# EAGLE design Blocky_ESP32 (EAGLE 9.2.2)
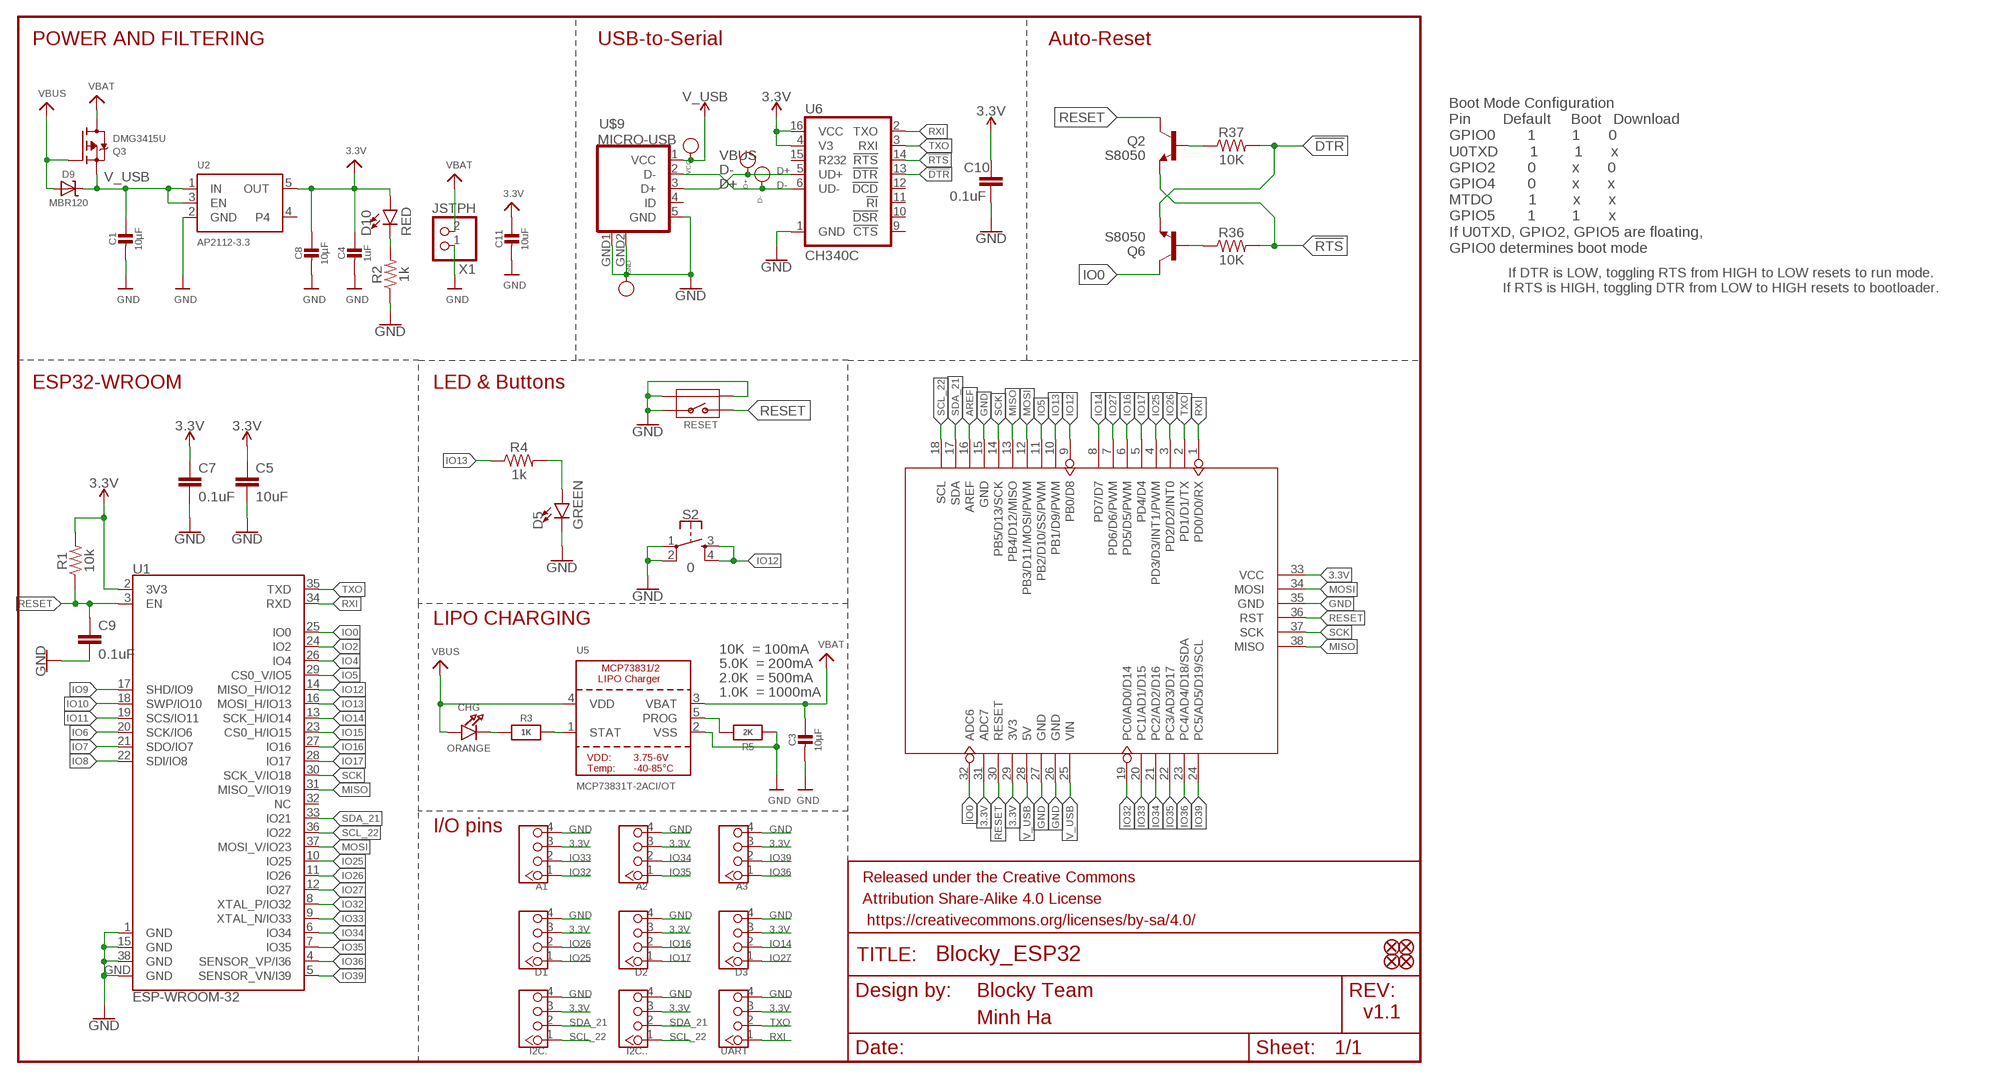
[diagram p0: schematic, sheet 1]

## Parts
A1  TWIG-4P-2.0-2.0  [4P-2.0]
A2  TWIG-4P-2.0-2.0  [4P-2.0]
A3  TWIG-4P-2.0-2.0  [4P-2.0]
C1  10µF  CAP_CERAMIC_0603  [_0603]
C3  10µF  CAP_CERAMIC_0603  [_0603]
C4  1uF  CAP_CERAMIC_0603  [_0603]
C5  10uF  10UF-0603-6.3V-20%  [0603]
C7  0.1uF  0.1UF-0603-25V-(+80/-20%)  [0603]
C8  10µF  CAP_CERAMIC_0603  [_0603]
C9  0.1uF  0.1UF-0603-25V-(+80/-20%)  [0603]
C10  0.1uF  0.1UF-0603-25V-5%  [0603]
C11  10uF  CAP_CERAMIC_0603  [_0603]
CHG  ORANGE  LED0603  [CHIPLED_0603]
D1  TWIG-4P-2.0-2.0  [4P-2.0]
D2  TWIG-4P-2.0-2.0  [4P-2.0]
D3  TWIG-4P-2.0-2.0  [4P-2.0]
D5  GREEN  LED-BLUE0603  [LED-0603]
D9  MBR120  DIODE-SCHOTTKYSOD-123  [SOD-123]
D10  RED  LED-RED0603  [LED-0603]
D+  PAD-TEST-POINT'4545'  [TP_4545]
D-  PAD-TEST-POINT'4545'  [TP_4545]
FD1  FIDUCIAL1X2  [FIDUCIAL-1X2]
FD2  FIDUCIAL1X2  [FIDUCIAL-1X2]
FD3  FIDUCIAL1X2  [FIDUCIAL-1X2]
FD4  FIDUCIAL1X2  [FIDUCIAL-1X2]
FRAME1  FRAME-LETTERNO_PACKAGE  [DUMMY]
GND  PAD-TEST-POINT'4545'  [TP_4545]
I2C.  TWIG-4P-2.0-2.0  [4P-2.0]
I2C..  TWIG-4P-2.0-2.0  [4P-2.0]
Q2  S8050  TRANSISTOR_NPNSOT23-3  [SOT23-3]
Q3  DMG3415U  MOSFET-P  [SOT23-R]
Q6  S8050  TRANSISTOR_NPNSOT23-3  [SOT23-3]
R1  10k  10KOHM-0603-1/10W-1%  [0603]
R2  1k  1KOHM-0603-1/10W-1%  [0603]
R3  1K  RESISTOR_0603_NOOUT  [0603-NO]
R4  1k  1KOHM-0603-1/10W-1%  [0603]
R5  2K  RESISTOR_0603_NOOUT  [0603-NO]
R36  10K  0.27OHM-0603-1/10W-1%  [0603]
R37  10K  0.27OHM-0603-1/10W-1%  [0603]
RESET  BUTTON-4P-REINFORCE'TS-1188E'  [4P-SMD-7X3.5X3.5H]
S2  0  MOMENTARY-SWITCH-SPST-2-SMD-4.6X2.8MM  [TACTILE_SWITCH_SMD_4.6X2.8MM]
U1  ESP-WROOM-32  [ESP-WROOM-32]
U2  AP2112-3.3  VREG_SOT23-5  [SOT23-5]
U3  ARDUINO-38P  [ARDUINO-38P]
U5  MCP73831T-2ACI/OT  MCP73831/2  [SOT23-5]
U6  CH340C  [SO016]
U$9  MICRO-USB  [MICRO-USB]
UART  TWIG-4P-2.0-2.0  [4P-2.0]
VCC  PAD-TEST-POINT'4545'  [TP_4545]
X1  JSTPH  CON_JST_PH_2PIN  [JSTPH2]

## Nets
3.3V [usbvcc]: A1.3 A2.3 A3.3 C4.1 C5.1 C7.1 C8.1 C10.1 C11.1 D1.3 D2.3 D3.3 D10.A I2C..3 I2C...3 R1.2 U1.2(3V3) U2.5(OUT) U3.29(3V3) U3.31(ADC7) U3.33(VCC) U6.4(V3) U6.16(VCC) UART.3
!DTR: Q6.2(E) R37.2 U6.13(!DTR)
!RTS: Q2.2(E) R36.2 U6.14(!RTS)
AREF: U3.16(AREF)
D+: D+.T U6.5(UD+) U$9.3(D+)
D-: D-.T U6.6(UD-) U$9.2(D-)
GND: A1.4 A2.4 A3.4 C1.2 C3.2 C4.2 C5.2 C7.2 C8.2 C9.2 C10.2 C11.2 D1.4 D2.4 D3.4 D5.C GND.T I2C..4 I2C...4 R2.1 R5.1 RESET.1 RESET.S1 RESET.S2 S2.1 S2.2 U1.1(GND) U1.15(GND) U1.38(GND) U1.GND U2.2(GND) U3.15(GND) U3.26(GND) U3.27(GND) U3.35(GND) U5.2(VSS) U6.1(GND) U$9.5(GND) U$9.GND1(GND) U$9.GND2(GND) UART.4 X1.1
IO0: Q6.3(C) U1.25(IO0) U3.32(ADC6)
IO2: U1.24(IO2)
IO4: U1.26(IO4)
IO5: U1.29(CS0_V/IO5) U3.11(PB2/D10/SS/PWM)
IO6: U1.20(SCK/IO6)
IO7: U1.21(SDO/IO7)
IO8: U1.22(SDI/IO8)
IO9: U1.17(SHD/IO9)
IO10: U1.18(SWP/IO10)
IO11: U1.19(SCS/IO11)
IO12: S2.3 S2.4 U1.14(MISO_H/IO12) U3.9(PB0/D8)
IO13: R4.1 U1.16(MOSI_H/IO13) U3.10(PB1/D9/PWM)
IO14: D3.2 U1.13(SCK_H/IO14) U3.8(PD7/D7)
IO15: U1.23(CS0_H/IO15)
IO16: D2.2 U1.27(IO16) U3.6(PD5/D5/PWM)
IO17: D2.1 U1.28(IO17) U3.5(PD4/D4)
IO25: D1.1 U1.10(IO25) U3.4(PD3/D3/INT1/PWM)
IO26: D1.2 U1.11(IO26) U3.3(PD2/D2/INT0)
IO27: D3.1 U1.12(IO27) U3.7(PD6/D6/PWM)
IO32: A1.1 U1.8(XTAL_P/IO32) U3.19(PC0/AD0/D14)
IO33: A1.2 U1.9(XTAL_N/IO33) U3.20(PC1/AD1/D15)
IO34: A2.2 U1.6(IO34) U3.21(PC2/AD2/D16)
IO35: A2.1 U1.7(IO35) U3.22(PC3/AD3/D17)
IO36: A3.1 U1.4(SENSOR_VP/I36) U3.23(PC4/AD4/D18/SDA)
IO39: A3.2 U1.5(SENSOR_VN/I39) U3.24(PC5/AD5/D19/SCL)
MISO: U1.31(MISO_V/IO19) U3.13(PB4/D12/MISO) U3.38(MISO)
MOSI: U1.37(MOSI_V/IO23) U3.12(PB3/D11/MOSI/PWM) U3.34(MOSI)
N$1: CHG.C R3.1
N$2: D5.A R4.2
N$3: Q2.1(B) R37.1
N$4: D10.C R2.2
N$7: Q6.1(B) R36.1
PROG: R5.2 U5.5(PROG)
RESET: C9.1 Q2.3(C) R1.1 RESET.2 U1.3(EN) U3.30(RESET) U3.36(RST)
RXI: U1.34(RXD) U3.1(PD0/D0/RX) U6.2(TXO) UART.1
SCK: U1.30(SCK_V/IO18) U3.14(PB5/D13/SCK) U3.37(SCK)
SCL_22: I2C..1 I2C...1 U1.36(IO22) U3.18(SCL)
SDA_21: I2C..2 I2C...2 U1.33(IO21) U3.17(SDA)
STAT: R3.2 U5.1(STAT)
TXO: U1.35(TXD) U3.2(PD1/D1/TX) U6.3(RXI) UART.2
V_USB [usbvcc]: C1.1 D9.C Q3.2(S) U2.1(IN) U2.3(EN) U3.25(VIN) U3.28(5V)
VBAT [usbvcc]: C3.1 Q3.3(D) U5.3(VBAT) X1.2
VBUS [usbvcc]: CHG.A D9.A Q3.1(G) U5.4(VDD) U$9.1(VCC) VCC.T ; supply symbol labelled V_USB
Unconnected: U1.32(NC) U2.4 U6.9(!CTS) U6.10(!DSR) U6.11(!RI) U6.12(!DCD) U6.15(R232) U$9.4(ID)

## Notes on the sheet
- POWER AND FILTERING | USB-to-Serial | Auto-Reset
- Boot Mode Configuration
  Pin        Default     Boot   Download
  GPIO0        1         1       0
  U0TXD        1         1       x
  GPIO2        0         x       0
  GPIO4        0         x       x
  MTDO         1         x       x
  GPIO5        1         1       x
  If U0TXD, GPIO2, GPIO5 are floating, 
  GPIO0 determines boot mode
- If DTR is LOW, toggling RTS from HIGH to LOW resets to run mode.
  If RTS is HIGH, toggling DTR from LOW to HIGH resets to bootloader.
- ESP32-WROOM | LED & Buttons
- LIPO CHARGING
- 10K  = 100mA
- 5.0K  = 200mA
- 2.0K  = 500mA
- 1.0K  = 1000mA
- I/O pins
- Blocky Team
- v1.1
- Minh Ha

## Library data of the parts
A1 = Connector :TWIG-4P-2.0
A2 A3 D1-D3 I2C. I2C.. UART = Connector:TWIG-4P-2.0
C1 C3 C4 C8 C11 = microbuilder:CAP_CERAMIC: Ceramic Capacitors For new designs, use the packages preceded by an '_' character since they are more reliable: The following footprints should be used on most boards: _0402 - Standard footprint for regular board layouts _0603 - Standard footprint for regular board layouts _0805 - Standard footprint for regular board layouts _1206 - Standard footprint for regular board layouts For extremely tight-pitch boards where space is at a premium, the following 'micro-pitch' footprints can be used (smaller pads, no silkscreen outline, etc.): _0402MP - Micro-pitch footprint for very dense/compact boards _0603MP - Micro-pitch footprint for very dense/compact boards _0805MP - Micro-pitch footprint for very dense/compact boards _1206MP - Micro-pitch footprint for very dense/compact boards
C5 = SparkFun-Capacitors:10UF: 10.0µF ceramic capacitors A capacitor is a passive two-terminal electrical component used to store electrical energy temporarily in an electric field.; PROD_ID: CAP-11015
C7 C9 = SparkFun-Capacitors:0.1UF: 0.1µF ceramic capacitors A capacitor is a passive two-terminal electrical component used to store electrical energy temporarily in an electric field.; PROD_ID: CAP-00810
C10 = SparkFun-Capacitors:0.1UF: 0.1µF ceramic capacitors A capacitor is a passive two-terminal electrical component used to store electrical energy temporarily in an electric field.; PROD_ID: CAP-08604
CHG = microbuilder:LED: LED 0603 - 0603 Surface Mount Package 2mA: Green LED - Low Power (3.9mcd, 2ma, 1.7Vf) - Digikey: 475-2709-2-ND Orange LED - Low Power (9.8mcd, 2ma, 1.8Vf) - Digikey: 475-1194-2-ND Red LED - Low Power (5mcd, 2ma, 1.8Vf) - Digikey: 475-1195-2-ND Yellow LED - Low Power (7mcd, 2ma, 1.8Vf) - Digikey: 475-1196-2-ND 5mA: Blue LED - Low Power (17mcd, 5ma, 2.9Vf) - Digikey: LNJ937W8CRACT-ND 0805 - 0805 Surface Mount Package 2mA: Red LED (8.8mcd, 2mA, 1.8Vf, Clear) - Low Power [Digikey: 475-2510-1-ND] Green LED (5mcd, 2mA, 1.8Vf, Clear) - Low Power [Digikey: 475-2730-1-ND] Yellow LED (11.3mcd, 2mA, 1.8Vf, Clear) - Low Power [Digikey: 475-2555-1-ND] 20mA: Red LED (104mcd, 20mA, Diffused) - LS R976 [Digikey: 475-1278-6-ND] Red LED (12mcd, 20mA, 2.0Vf, Clear) - APT2012EC [Digikey: 754-1128-1-ND] Green LED (15mcd, 20mA, 2.2Vf, Clear) - APT2012GC [Digikey: 754-1131-1-ND] Orange LED (160mcd, 20mA, 2.1Vf, Clear) - APT2012SECK [Digikey: 754-1130-1-ND] 1206 - 1206 Surface Mount Package Green LED (26mcd, 20mA, Diffused) - LG N971 [Digikey: 475-1407-6-ND] Red LED (15mcd, 20mA, Diffused) - LH N974 [Digikey: 475-1416-6-ND] Cree - Cree High-Power Surface Mount LEDs XPEBWT-L1-0000-00D50 - White 111lm 350mA 2.9Vf 6200K 110° XTEAWT-00-0000-00000LEE3 - White 114lm 350mA 2.85Vf 5000K 115° Everlight - Everlight 45-21 Series Surface Mount LEDs 45-21/QK2C-B2832AC2CB2/2T - Warm White 2000mcd 20mA 3.25Vf 3050K 120° 45-21/LK2C-B38452C4CB2/2T - Nuetral White 2000mcd 20mA 3.25Vf 4150K 120° 45-21/LK2C-B50634C6CB2/2T - Cold White 2200mcd 20mA 3.25Vf 5650K 120° PLCC2 Reverse Mount LS T77K-J1L2-1-0-2-R18-Z - Red 11.25mcd 2mA 1.8Vf 630nm 120° LO T77K-L1M2-24-Z - Orange 19.6mcd 2mA 1.8Vf 606nm 120° LY T77K-K2M1-26-Z - Yellow 15.7mcd 2mA 1.8Vf 587nm 120°
D5 = SparkFun-LED:LED-BLUE: Blue SMD LED Used in manufacturing of various products at SparkFun Packages: 0603 - SMD 0603 package [Product Link] <http://www.digikey.com/product-detail/en/SMLE12BC7TT86/511-1589-2-ND/1641808> 1206 - SMD1206 package [Product Link] <http://www.digikey.com/product-detail/en/lite-on-inc/LTST-C150TBKT/160-1643-1-ND/573584> SparkFun Products: ESP8266 Thing-Dev Board <https://www.sparkfun.com/products/13711> RedBoard <https://www.sparkfun.com/products/12757>; PROD_ID: DIO-08575; VALUE: BLUE
D9 = microbuilder:DIODE-SCHOTTKY
D10 = SparkFun-LED:LED-RED: Red SMD LED Used in manufacturing of most products at SparkFun Packages: 0603 - SMD 0603 package [Product Link] <http://docs.avagotech.com/docs/AV02-0551EN> 0603 SMART - SMD 0603 SMART package ( more efficient and expensive)[Product Link] <http://www.osram-os.com/Graphics/XPic2/00077099_0.pdf> 1206 - SMD1206 package [Product Link] <https://www.sparkfun.com/datasheets/DevTools/LilyPad/Q150OVS4.pdff> SparkFun Products: Pro Mini 328 -5V <https://www.sparkfun.com/products/821> RedBoard <https://www.sparkfun.com/products/12757> IOIO-OTG <https://www.sparkfun.com/products/13613>; PROD_ID: DIO-00819
D+ D- GND VCC = Discrete:PAD-TEST-POINT; PARTNO: DNP
FD1-FD4 = SparkFun-Aesthetics:FIDUCIAL: Fiducial Alignment Points Point-of-reference for pick-and-place machines and other optical instruments.
FRAME1 = SparkFun-Aesthetics:FRAME-LETTER: Schematic Frame Standard 8.5x11 US Letter frame; DESIGNER: Nobody; VERSION: v01
Q2 Q6 = SparkFun:TRANSISTOR_NPN: Transistor NPN BJT configuration in SOT23 package. MMBT2222 is the common NPN we use. Double check BCE configuration again layout.
Q3 = microbuilder:MOSFET-P: P-Channel Mosfet LEGEND VDS: Voltage Drain-Source ID: Drain Current RDS(ON): Drain-Source On-State Resistance VGS(TH): Gate-Source Threshold Voltage CISS: Drain-Source Input Capacitance SOT-23 Name VDS ID RDS(ON) VGS(TH) CISS Order Number IRLML5103 30V 760mA 600 mOhm -- 75pF @ 25V Digikey: IRLML5103PBFCT-ND IRLML6401 12V 4.3A 50 mOhm 950mV @ 250µA 830pF @ 10V Digikey: IRLML6401PBFTR-ND NTR0202PL 20V 400mA 800 mOhm 2.3V @ 250uA 70pF @ 5V Digikey: NTR0202PLT1GOSTR-ND NTR4101PT1G 20V 1.8A 85 mOhm 1.2V @ 250uA 675pF @ 10V Digikey: NTR4101PT1GOSCT-ND DMP2004K 20V 600mA 900 mOhm 1V @ 250uA 175pF @ 16V Digikey: DMP2004KDICT-ND PMV65XP 20V 3.9A 76 mOhm 950mV @ 1mA 725pF @ 20V Digikey: 568-2358-2-ND TO-252 Name VDS ID RDS(ON) VGS(TH) CISS Order Number AOD417 30V 25A 34 mOhm 3V @ 250µA 920pF @ 15V Digikey: 785-1106-2-ND PowerPak Name VDS ID RDS(ON) VGS(TH) CISS Order Number AON7401 30V 12A 14 mOhm 3V @ 250µA 2600pF @ 15V Digikey: 785-1302-1-ND
R1 = SparkFun-Resistors:10KOHM: 10kΩ resistor A resistor is a passive two-terminal electrical component that implements electrical resistance as a circuit element. Resistors act to reduce current flow, and, at the same time, act to lower voltage levels within circuits. - Wikipedia; PROD_ID: RES-00824
R2 R4 = SparkFun-Resistors:1KOHM: 1kΩ resistor A resistor is a passive two-terminal electrical component that implements electrical resistance as a circuit element. Resistors act to reduce current flow, and, at the same time, act to lower voltage levels within circuits. - Wikipedia; PROD_ID: RES-07856
R3 R5 = microbuilder:RESISTOR: Resistors For new designs, use the packages preceded by an '_' character since they are more reliable: The following footprints should be used on most boards: _0402 - Standard footprint for regular board layouts _0603 - Standard footprint for regular board layouts _0805 - Standard footprint for regular board layouts _1206 - Standard footprint for regular board layouts For extremely tight-pitch boards where space is at a premium, the following 'micro-pitch' footprints can be used (smaller pads, no silkscreen outline, etc.): _0402MP - Micro-pitch footprint for very dense/compact boards _0603MP - Micro-pitch footprint for very dense/compact boards _0805MP - Micro-pitch footprint for very dense/compact boards _1206MP - Micro-pitch footprint for very dense/compact boards
R36 R37 = SparkFun-Resistors:0.27OHM: 0.27Ω resistor A resistor is a passive two-terminal electrical component that implements electrical resistance as a circuit element. Resistors act to reduce current flow, and, at the same time, act to lower voltage levels within circuits. - Wikipedia; PROD_ID: RES-08787; VALUE: 0.27
RESET = Discrete:BUTTON-4P-REINFORCE: TS-1188E http://www.best-dz.com/?thread-374-2.html
S2 = SparkFun-Switches:MOMENTARY-SWITCH-SPST-2: Momentary Switch (Pushbutton) - SPST - Two Circuits Normally-open (NO) SPST momentary switches (buttons, pushbuttons). Schematic symbol includes two switch circuits. Variants SMD-4.6MMX2.8MM - 4.60mm x 2.80mm Tactile Momentary Button Switch - Used on SparkFun SAMD21 Mini Breakout <https://www.sparkfun.com/products/13664> SMD-5.2MM - Mini Pushbutton Switch - SMD <https://www.sparkfun.com/products/8720> - Used on Arduino Pro Mini <https://www.sparkfun.com/products/11114>; PROD_ID: SWCH-13065
U1 = SparkFun-RF:ESP-WROOM-32; PROD_ID: IC-13849
U2 = microbuilder:VREG_SOT23-5: SOT23-5 Fixed Voltage Regulators Part Current Out V Out V In V Dropout θJA (°C/W) TJ (°C) Digikey Part No. ADP121 150mA 3.3V 3.4-5.5V 0.09V @ 150mA -- -- ADP121-AUJZ33R7CT-ND ADP121 150mA 3.0V 3.1-5.5V 0.09V @ 150mA -- -- ADP121-AUJZ30R7CT-ND ADP122 300mA 3.3V 3.4-5.5V 0.085V @ 300mA -- -- ADP122AUJZ-3.3-R7CT-ND ADP1712 300mA 3.3V 3.5-5.5V 0.17V @ 300mA -- -- ADP1712AUJZ-3.3-R7TR-ND AP7311 (Low Cost) 150mA 3.3V 3.5-6V 0.15V @ 150mA -- -- AP7311-33WG-7DICT-ND LD39015M18R 150mA 1.8V 1.9V-5.5V 0.08V @ 100mA -- -- 497-6977-1-ND LP2985A-33DBVR 150mA 3.3V 3.3-16V 0.28V @ 150mA 206 150 296-18479-1-ND MCP1824T-3302E/OT 300mA 3.3V 3.5V-6V 0.2V @ 300mA -- -- MCP1824T-3302E/OTCT-ND MIC5205-2.5YM5 TR 150mA 2.5V 2.7-16V 0.165V @ 150mA -- -- 576-1257-2-ND MIC5205-3.0YM5 TR 150mA 3.0V 3.2V-16V 0.165V @ 150mA -- -- 576-1258-2-ND MIC5205-3.3YM5 TR 150mA 3.3V 3.5V-16V 0.165V @ 150mA -- -- 576-1259-2-ND TPS780330220 150mA 3.3V+2.2V 3.6-5.5V 250mV Max -- -- 296-23332-1-ND TDA3663/N1,135 100mA 3.3V 3.5-45V 0.18V @ 50mA -- -- 568-5343-1-ND Max operating temp can be calculated using θJA, TJ (max junction temperature), and power in watts. Set the "Maximum Ambient Temperature" until it reaches TJ ("Max Junction Temperature"), which is the absolute limit for safe use of the regulator: Heat Sink Temperature Calculator <http://www.daycounter.com/Calculators/Heat-Sink-Temperature-Calculator.phtml> For example, With 12V source into a 3.3V LP2985 and a 30mA load, we are dissipating (12V-3.3V) * 0.03A = 0.261W. With a θJA of 206 °C/W, a TJ of 150°C, and 261mW we can safely use the chip without a heat sink up to 75°C (=147.1°C Junction Temperature).
U3 = moudle:ARDUINO-38P
U5 = microbuilder:MCP73831/2: MCP73831/2 LIPO Charger VDD: 3.75 - 6V Temp -40 - 85°C Programmable Charge Rate: 15-500mA NOTE: STAT is a tri-state logic output on the MCP73831 and an open-drain output on the MCP73832. SOT23-5 with 4.2V output and tri-state logic on STAT = MCP73831T-2ACI/OT
U6 = SparkFun-IC-Comms:CH340C; PROD_ID: IC-14038
U$9 = My-Eagle-Lib:MICRO-USB: Micro USB B connector
X1 = microbuilder:CON_JST_PH_2PIN: JST 2-Pin Right-Angle Connector PH-Series - 4UConnector: 17311 SH-Series - 4UConnector: 07278

## Net classes
3 usbvcc: width 0.203 mm, drill 0.305 mm, clearance 0.203 mm

## Board
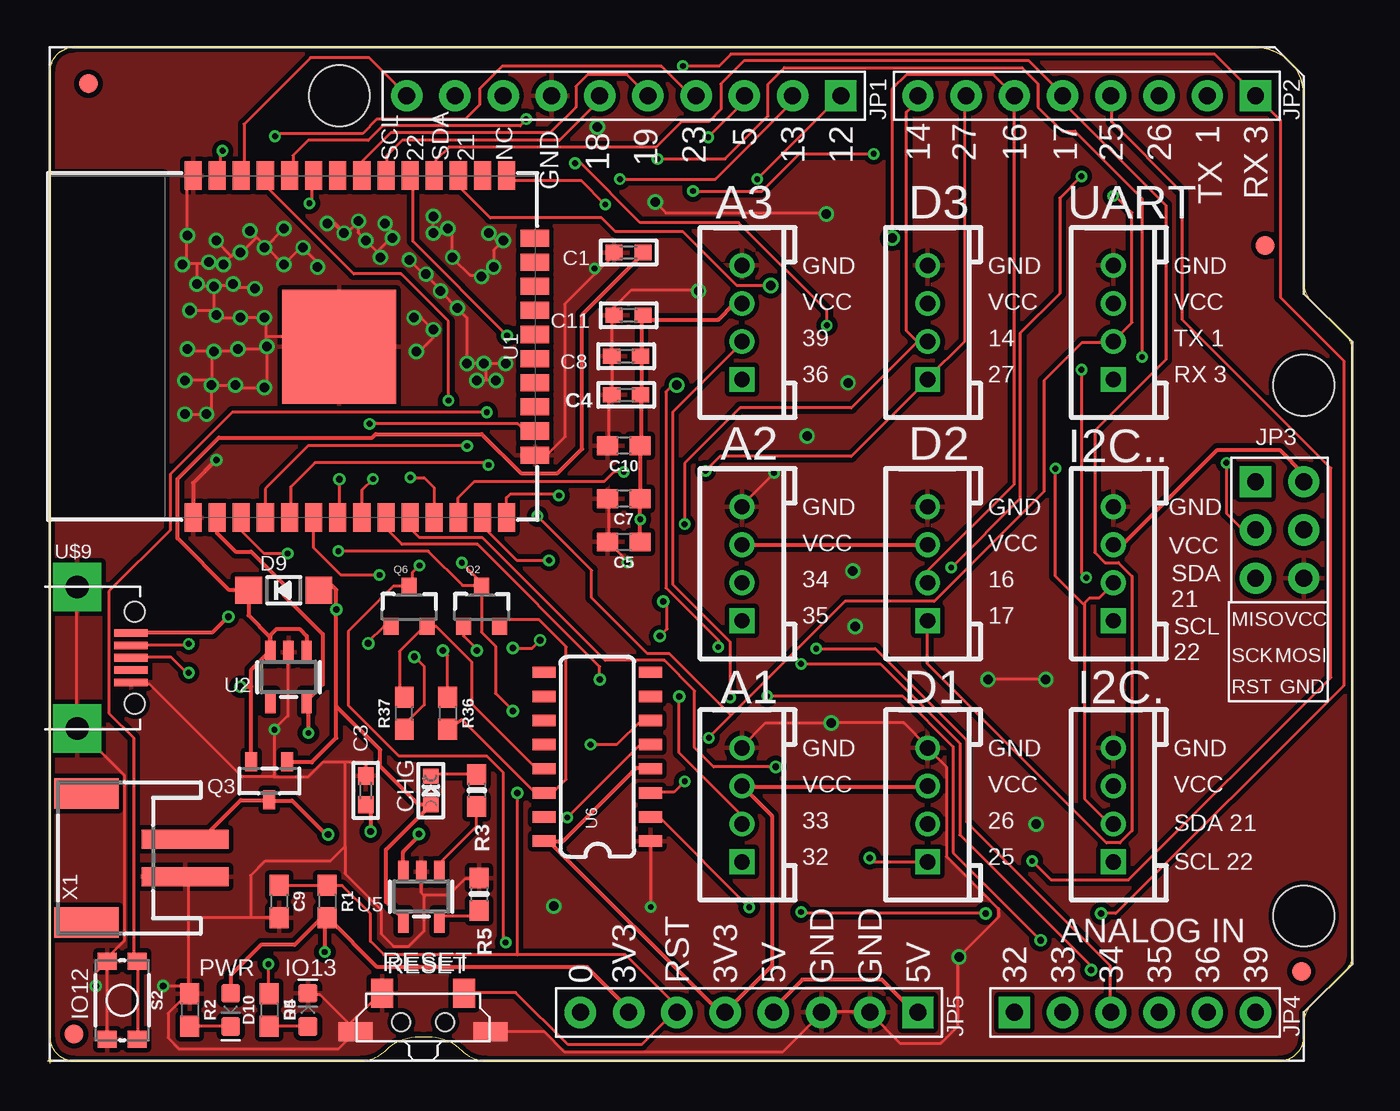
[diagram p1: board, top side]
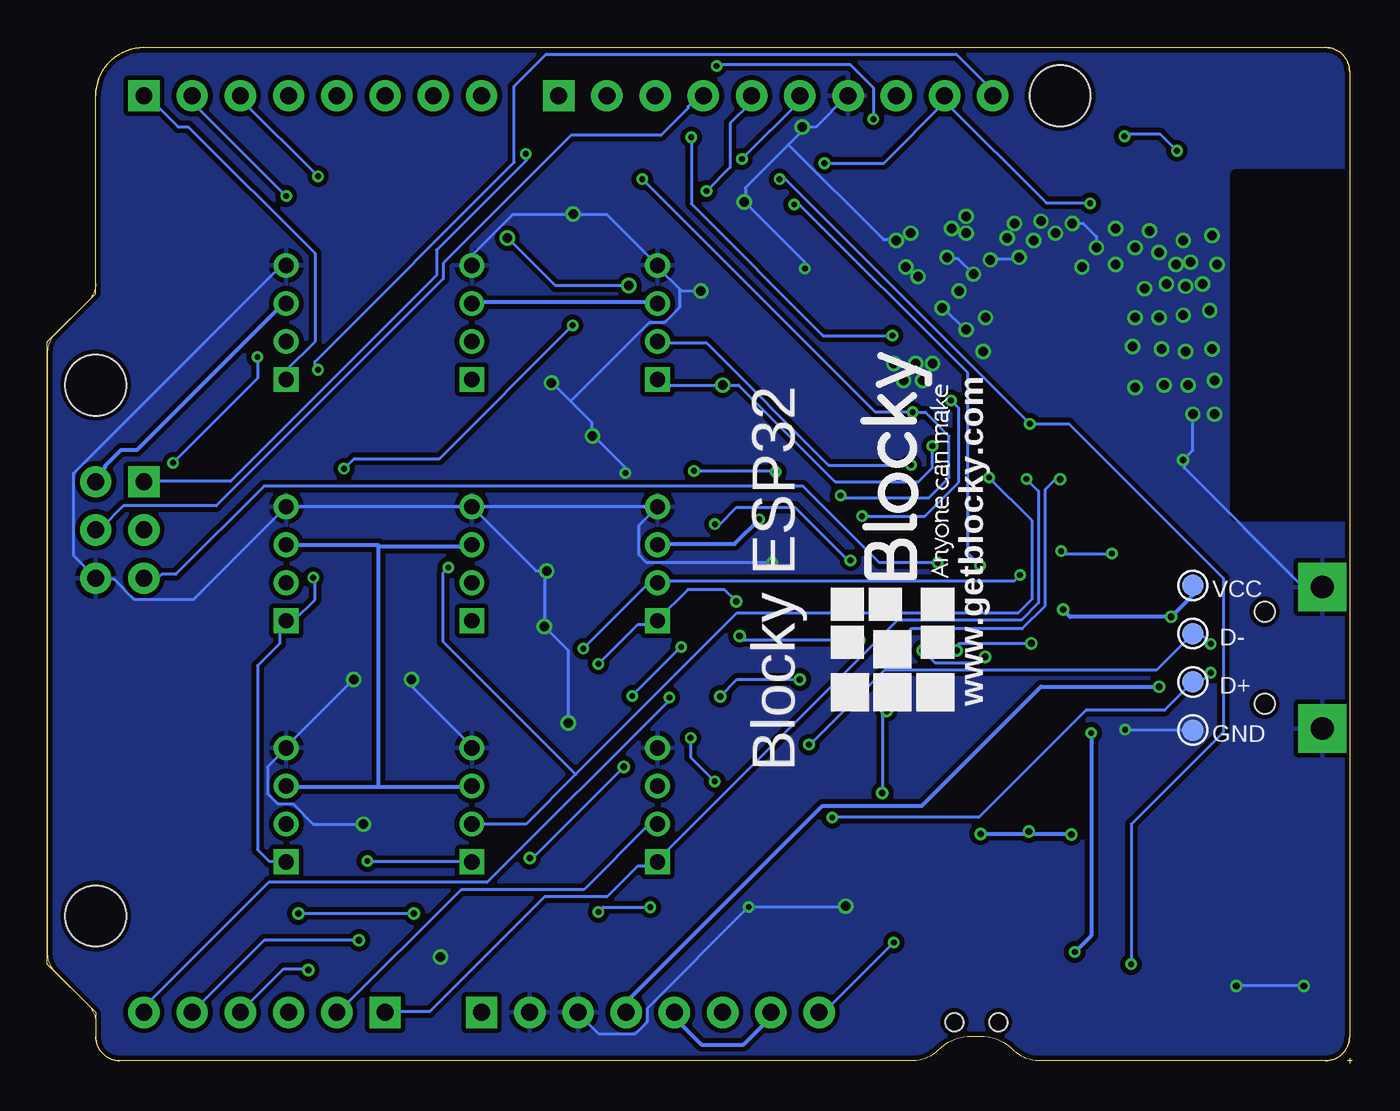
[diagram p2: board, bottom side, seen from below]

Size 68.71 x 53.47 mm. Coordinates in mm from the lower left corner, seen from the top.
Outline: 1.4,0.13 arc-90 0.13,1.4
Outline: 0.13,52.2 arc-90 1.4,53.47
Outline: 63.63,53.47 arc-90 66.17,50.93
Outline: 66.17,41.04 arc45 66.54,40.14 68.33,38.35 arc-45 68.71,37.45 68.71,5.73 arc-45 68.33,4.83 66.54,3.04 arc45 66.17,2.14
Outline: 66.17,2.14 66.17,1.4
Outline: 66.17,1.4 arc-90 64.9,0.13
Outline: 0.13,1.4 arc90 1.4,0.13
Outline: 64.9,0.13 arc90 66.17,1.4
Outline: 1.4,53.47 arc90 0.13,52.2
Outline: 0.13,1.4 arc90 1.4,0.13
Outline: 64.9,0.13 arc90 66.17,1.4
Outline: 66.17,50.93 arc90 63.63,53.47
Outline: 66.17,1.4 arc-90 64.9,0.13
Outline: 1.4,53.47 arc90 0.13,52.2
Outline: 0.13,1.4 arc90 1.4,0.13
Outline: 66.17,41.04 66.17,40.51 68.71,37.97 68.71,5.21 66.17,2.67 66.17,2.14
Outline: 66.17,50.93 arc90 63.63,53.47
Outline: 21.83,0.65 arc45 23.1,0.13
Outline: 16.53,0.13 arc45 17.8,0.65
Outline: 17.8,0.65 arc-45 19.59,1.4
Outline: 20.03,1.4 arc-45 21.83,0.65
Outline: 0.13,1.4 arc90 1.4,0.13
Outline: 64.9,0.13 arc90 66.17,1.4
Outline: 1.4,53.47 arc90 0.13,52.2
Outline: 0.13,1.4 arc90 1.4,0.13
Outline: 64.9,0.13 arc90 66.17,1.4
Outline: 66.17,50.93 arc90 63.63,53.47
Outline: 66.17,1.4 arc-90 64.9,0.13
Outline: 63.63,53.47 1.4,53.47
Outline: 1.4,53.47 arc90 0.13,52.2
Outline: 0.13,52.2 0.13,1.4
Outline: 0.13,1.4 arc90 1.4,0.13
Outline: 66.17,41.04 66.17,50.93
Outline: 66.17,50.93 arc90 63.63,53.47
Outline: 21.83,0.65 arc45 23.1,0.13
Outline: 23.1,0.13 64.9,0.13
Outline: 1.4,0.13 16.53,0.13
Outline: 16.53,0.13 arc45 17.8,0.65
Outline: 17.8,0.65 arc-45 19.59,1.4
Outline: 19.59,1.4 20.03,1.4
Outline: 20.03,1.4 arc-45 21.83,0.65
Outline: 0,0.13 0.25,0.13
Outline: 0.13,0.25 0.13,0
Copper layers (1*16): Top 0.035mm / dielectric 1.5mm / Bottom 0.035mm
Design rules "SeeedStudio_rule_no_angle_090911 *": minimum track width 6mil, minimum drill 12mil, track to track 8mil, track to pad 8mil, pad to pad 8mil, via to via 8mil, smd to smd 0mil, copper to edge 10mil, drill to drill 10mil, minimum pad ring 10mil, minimum via ring 6mil, stop-mask expansion 2mil, vias tented up to drill 100mil, thermal gap 10mil
tRestrict: area 0.3,28.8 to 6.1,46.7
bRestrict: area 0.3,28.8 to 6.1,46.7

### Footprints (pad centres in the part's own frame; a part is rotated, then mirrored left to right if it is on the bottom)
4P-2.0 = drill 0.8 pad 1.27 square: 1 -3,0 | drill 0.8 pad 1.27: 2 -1,0; 3 1,0; 4 3,0
_0603 = smd 0.9 x 0.8: 1 -0.762,0; 2 0.762,0
0603 = smd 1.1 x 1: 1 -0.85,0; 2 0.85,0
CHIPLED_0603 = smd 0.8 x 0.8: A 0,-0.75; C 0,0.75
LED-0603 = smd 1 x 1: A -0.877,0; C 0.877,0
SOD-123 = smd 1.4 x 1.4: A 1.85,0; C -1.85,0
TP_4545 = smd 1.143 x 1.143: T 0,0
FIDUCIAL-1X2 = smd 1 x 1: 1 0,0
SOT23-3 = smd 0.8 x 0.9: 1 -0.95,-1; 2 0.95,-1; 3 0,1.1
SOT23-R = smd 0.635 x 1.016: 1 -0.95,-1; 2 0.95,-1; 3 0,1
0603-NO = smd 1.075 x 1: 1 -0.85,0; 2 0.85,0
4P-SMD-7X3.5X3.5H = smd 1.143 x 1.524: 1 -2.159,1.524; 2 2.159,1.524 | smd 1.778 x 1.016: S1 -3.556,-0.508; S2 3.556,-0.508 | hole 0.95: -1.15,0; 1.15,0
TACTILE_SWITCH_SMD_4.6X2.8MM = smd 0.9 x 1: 1 -2.05,-0.8; 2 2.05,-0.8; 3 2.05,0.8; 4 -2.05,0.8
ESP-WROOM-32 = smd 0.9 x 1.5: 1 7.7,9; 2 6.43,9; 3 5.16,9; 4 3.89,9; 5 2.62,9; 6 1.35,9; 7 0.08,9; 8 -1.19,9; 9 -2.46,9; 10 -3.73,9; 11 -5,9; 12 -6.27,9; 13 -7.54,9; 14 -8.81,9; 25 -8.81,-9; 26 -7.54,-9; 27 -6.27,-9; 28 -5,-9; 29 -3.73,-9; 30 -2.46,-9; 31 -1.19,-9; 32 0.08,-9; 33 1.35,-9; 34 2.62,-9; 35 3.89,-9; 36 5.16,-9; 37 6.43,-9; 38 7.7,-9 | smd 1.5 x 0.9: 15 -10.3,5.715; 16 -10.3,4.445; 17 -10.3,3.175; 18 -10.3,1.905; 19 -10.3,0.635; 20 -10.3,-0.635; 21 -10.3,-1.905; 22 -10.3,-3.175; 23 -10.3,-4.445; 24 -10.3,-5.715 | smd 6 x 6: GND 0,0
SOT23-5 = smd 0.55 x 1.2: 1 -0.95,-1.3; 2 0,-1.3; 3 0.95,-1.3; 4 0.95,1.3; 5 -0.95,1.3
ARDUINO-38P = drill 0.889 pad 1.651 square: 1 63.5,50.8; 9 41.656,50.8; 19 50.8,2.54; 25 45.72,2.54; 38 63.5,30.48 | drill 0.889 pad 1.651: 2 60.96,50.8; 3 58.42,50.8; 4 55.88,50.8; 5 53.34,50.8; 6 50.8,50.8; 7 48.26,50.8; 8 45.72,50.8; 10 39.116,50.8; 11 36.576,50.8; 12 34.036,50.8; 13 31.496,50.8; 14 28.956,50.8; 15 26.416,50.8; 16 23.876,50.8; 17 21.336,50.8; 18 18.796,50.8; 20 53.34,2.54; 21 55.88,2.54; 22 58.42,2.54; 23 60.96,2.54; 24 63.5,2.54; 26 43.18,2.54; 27 40.64,2.54; 28 38.1,2.54; 29 35.56,2.54; 30 33.02,2.54; 31 30.48,2.54; 32 27.94,2.54; 33 66.04,30.48; 34 66.04,27.94; 35 66.04,25.4; 36 63.5,25.4; 37 63.5,27.94 | hole 3.2: 15.24,50.8; 66.04,35.56; 66.04,7.62
SO016 = smd 0.6 x 1.2: 1 -4.445,-2.8; 2 -3.175,-2.8; 3 -1.905,-2.8; 4 -0.635,-2.8; 5 0.635,-2.8; 6 1.905,-2.8; 7 3.175,-2.8; 8 4.445,-2.8; 9 4.445,2.8; 10 3.175,2.8; 11 1.905,2.8; 12 0.635,2.8; 13 -0.635,2.8; 14 -1.905,2.8; 15 -3.175,2.8; 16 -4.445,2.8
MICRO-USB = smd 0.4 x 1.75: 1 -1.3,4.525; 2 -0.65,4.525; 3 0,4.525; 4 0.65,4.525; 5 1.3,4.525 | drill 1.2 pad 2.54 square: GND1 -3.725,1.7; GND2 3.725,1.7 | hole 1.05: -2.425,4.73; 2.425,4.73
JSTPH2 = smd 1 x 4.6: 1 -1,-3.7; 2 1,-3.7 | smd 1.6 x 3.4: NC1 -3.4,1.5; NC2 3.4,1.5

### Placement (x,y rotation side)
A1  36.58,13.59 90 top
A2  36.58,26.29 90 top
A3  36.58,38.99 90 top
C1  30.61,42.67 180 top
C3  16.76,14.35 90 top
C4  30.48,35.18 180 top
C5  30.35,27.43 180 top
C7  30.35,29.72 180 top
C8  30.48,37.21 180 top
C9  12.19,8.51 270 top
C10  30.35,32.51 180 top
C11  30.61,39.37 180 top
CHG  20.19,14.35 0 top
D1  46.36,13.59 90 top
D2  46.36,26.29 90 top
D3  46.36,38.99 90 top
D5  13.72,2.79 90 top
D9  12.45,24.89 0 top
D10  9.65,2.79 270 top
D+  8.38,20.07 0 bottom
D-  8.38,22.61 0 bottom
FD1  1.4,1.52 0 top
FD2  2.16,51.56 0 top
FD3  66.04,4.83 0 top
FD4  64.13,43.05 0 top
FRAME1  -6.22,-0.89 0 top  (outside the outline)
GND  8.38,17.53 0 bottom
I2C.  56.13,13.59 90 top
I2C..  56.13,26.29 90 top
Q2  22.86,24 0 top
Q3  11.68,14.86 180 top
Q6  19.05,24 0 top
R1  14.73,8.51 270 top
R2  7.49,2.79 270 top
R3  22.61,14.35 270 top
R4  11.68,2.79 270 top
R5  22.73,8.89 270 top
R36  21.08,18.41 270 top
R37  18.8,18.41 90 top
RESET  19.79,2.16 0 top
S2  3.94,3.3 270 top
U1  15.37,37.72 180 top
U2  12.7,20.32 180 top
U3  0.13,0.13 0 top
U5  19.68,8.76 180 top
U6  28.96,16.13 90 top
U$4  [BLOCKY_LOGO]  20.7,17.53 90 bottom
U$9  -0.13,21.34 270 top
UART  56.13,38.99 90 top
VCC  8.38,25.15 0 bottom
X1  3.56,10.79 90 top

### Tracks (layer width: path | path; a pad name or v marks a point on that pad's centre or on a via)
3.3V  (via drill 0.3)
  Top 0.203: 31.29,39.14 31.29,39.37 C11.1 | 31.29,39.14 31.29,37.21 C8.1 31.29,37.14 31.29,35.23 C4.1 31.27,35.15 31.27,32.58 C10.1 31.22,32.44 31.22,29.77 C7.1 31.22,29.69 v31.22,28.63 31.22,27.48 31.24,27.42 C5.1 | 31.29,39.14 35.33,39.14 36.17,39.98 36.55,39.98 A3.3 | A2.3 36.63,27.25 46.3,27.25 D2.3 | D1.3 46.3,14.53 36.63,14.53 A1.3 38.15,13.01 38.15,5.13 U3.29 35.64,2.72 35.36,2.72 26.39,11.68 U6.16 27.15,11.68 30.99,15.52 31.75,15.52 U6.4 | D10.A 9.65,4.62 11.25,6.22 13.01,6.22 14.38,7.59 14.68,7.59 14.71,7.68 R1.2 | U3.31 30.61,2.87 28.42,5.05 17.37,5.05 14.83,7.59 14.73,7.59 R1.2 | v13.74,17.37 13.74,18.93 U2.5 13.69,19.02 13.69,19.13 14.5,19.94 14.5,22.58 12.42,24.66 12.42,25.22 10.72,26.92 9.91,26.92 8.94,27.89 U1.2 | 14.61,7.53 14.61,7.51 | 14.61,7.51 v14.61,5.84 | U3.33 66.12,30.61 66.12,31.06 64.9,32.28 61.62,32.28 56.67,27.33 56.13,27.33 I2C...3 | 14.61,7.51 14.62,7.51 R1.2
  Bottom 0.203: D3.3 46.3,40.06 36.63,40.06 A3.3 | UART.3 56.29,39.98 63.98,32.28 64.82,32.28 65.66,31.45 65.66,31.37 66.12,30.91 66.12,30.61 U3.33 | 51.26,27.18 46.99,27.18 46.91,27.25 46.38,27.25 D2.3 | I2C...3 56.13,27.25 51.26,27.25 51.26,27.18 | 51.26,14.53 46.38,14.53 D1.3 | 51.26,14.53 56.13,14.53 I2C..3 | U3.31 30.61,2.41 32.05,0.96 34.27,0.96 35.64,2.34 35.64,2.64 U3.29 | v13.74,17.37 13.74,6.71 v14.61,5.84 | 51.26,14.53 51.26,27.18 | v31.22,28.63 32.51,27.33 36.55,27.33 A2.3
!DTR
  Top 0.152: U6.13 26.11,15.52 25.73,15.52 22.35,18.9 22.35,21.11 20.46,23 Q6.2 19.87,23 18.54,21.68 18.54,19.52 R37.2
!RTS
  Top 0.152: R36.2 21.82,18.08 25.64,14.26 26.12,14.26 U6.14 26.32,14.39 26.77,14.39 27.32,14.94 27.32,21.91 25.87,23.36 24.01,23.36 23.81,23.15 Q2.2
D+  (via drill 0.3)
  Top 0.152: v7.44,20.55 7.34,20.55 6.5,21.39 4.47,21.39 U$9.3 | v27.38,12.93 31.19,16.74 31.75,16.74 U6.5
  Bottom 0.152: v7.44,20.55 7.9,20.09 8.36,20.09 D+.T 9.88,18.57 14.02,18.57 19.66,12.93 v27.38,12.93
D-  (via drill 0.3)
  Top 0.152: v7.44,22.07 7.39,22.07 7.34,22.02 4.43,22.02 U$9.2 | U6.6 31.25,18.03 29.98,16.76 v28.6,16.76
  Bottom 0.152: v7.44,22.07 7.98,22.61 D-.T 10.29,20.7 24.61,20.7 28.55,16.76 v28.6,16.76
GND  (via drill 0.3, 0.35, 0.5)
  Top 0.152: 7.79,30.65 v8.89,31.75 | v7.24,34.16 v8.38,34.16 8.64,34.42 v8.64,35.69 | v8.64,35.69 8.38,35.94 v7.24,35.94 | v8.76,37.47 8.64,37.34 v8.64,35.69 | v8.64,35.69 v9.91,35.69 10.03,35.56 v11.43,35.56 11.56,35.69 v11.56,37.72 | v11.56,37.72 11.43,37.59 v10.03,37.59 9.91,37.47 v8.76,37.47 | v8.76,37.47 7.49,37.47 v7.37,37.59 | v31.77,8.22 31.77,11.68 U6.1 | RESET.S2 23.42,1.64 26.17,1.64 27.24,0.57 38.71,0.57 40.75,2.62 U3.27 40.84,2.71 43.27,2.71 U3.26 43.33,2.64 43.33,2.62 44.91,1.04 47.05,1.04 47.96,1.94 47.96,5.55 v48.01,5.59 48.04,5.64 50.09,7.68 50.09,8.13 47.33,10.88 47.33,15.6 46.36,16.57 D1.4 46.36,16.66 45.11,17.91 v41.28,17.91 37.82,17.91 36.58,16.66 A1.4 | v49.53,20.19 49.55,20.22 52.58,20.22 v52.58,20.19 | C7.2 29.55,29.64 29.55,27.51 C5.2 29.55,27.42 30.53,26.44 v30.53,26.35 | RESET.S1 16.22,1.73 14.35,3.59 13.73,3.59 D5.C | RESET.1 17.55,3.68 15.95,2.08 RESET.S1 | S2.1 3.15,5.28 3.15,1.26 S2.2 3.21,1.25 3.24,1.28 | 7.42,7.68 7.42,9.64 7.33,9.73 X1.1 | 7.42,7.68 7.42,3.68 | 7.42,7.68 10.69,7.68 | 10.69,7.68 12.13,7.68 C9.2 | 19.84,8.81 19.68,8.97 U5.2 | 19.84,8.81 19.88,8.77 | R5.1 22.71,9.73 22.02,9.73 21.14,8.85 19.96,8.85 19.91,8.79 | 15.67,15.86 14.53,15.86 13.73,15.06 12,15.06 11.96,15.11 | 15.67,15.86 16.76,15.86 C3.2 | 11.96,15.11 11.95,15.11 v11.95,17.55 11.95,17.56 12.66,18.27 12.66,21.59 U2.2 | U$9.5 4.48,19.95 5.37,19.95 10.26,15.06 11.91,15.06 11.96,15.11 | 15.67,11.41 15.67,15.86 | 19.91,8.79 19.84,8.73 19.84,6.96 19.02,6.15 18.22,6.15 17.58,6.79 17.58,8.06 15.67,9.97 15.67,11.41 | 10.69,7.68 10.69,9.87 11.47,10.64 14.91,10.64 15.67,11.41
  Top 0.152: C10.2 29.55,32.58 29.55,35.07 29.64,35.15 C4.2 29.73,35.24 29.73,37.19 C8.2 29.73,37.28 29.73,39.14 C11.2 29.84,39.79 30.75,40.69 34.24,40.69 v34.29,40.64 | U$9.GND1 1.55,25.02 1.55,17.63 U$9.GND2 1.63,17.55 1.64,17.55 4.04,15.15 4.04,6.44 3.15,5.55 3.15,5.37 S2.1 | C1.2 29.64,42.47 29.64,42.35 29.12,41.83 v28.82,41.83 28.87,41.78 28.87,41.58 27.27,39.98 27.27,32.98 26.35,32.07 25.67,32.07 25.64,32.04 U1.15 | v14.22,41.91 14.17,41.91 14.17,42.18 13.46,42.89 v13.46,42.93 13.46,42.8 13.2,42.8 12.48,42.09 v12.45,42.04 11.51,42.98 | 11.51,42.98 11.02,43.47 | 11.02,43.47 v10.67,43.82 | 11.51,42.98 12.4,43.87 v12.45,43.94 | 11.51,42.98 v11.43,42.93 | v8.89,39.37 8.66,39.6 7.51,39.6 v7.49,39.62 | v8.89,39.37 9.02,39.24 v10.16,39.24 v11.43,39.24 11.51,39.24 11.51,38.27 | v8.76,40.89 8.75,40.93 8.04,40.93 7.95,41.02 v7.87,41.02 7.86,41.02 7.86,42.09 | v8.76,40.89 8.84,40.93 9.64,40.93 9.73,41.02 v9.78,41.02 9.82,41.02 10,40.84 10.88,40.84 v10.92,40.77 | 7.86,42.09 8.48,42.09 v8.51,42.16 8.57,42.09 9.2,42.09 v9.27,42.04 9.28,42.09 9.68,42.49 | 7.86,42.09 7.33,42.09 | 7.33,42.09 7.15,42.09 v7.11,42.04 7.33,42.09 | 9.68,42.49 9.82,42.62 10.08,42.62 v10.16,42.67 10.17,42.62 11.02,43.47 | 9.68,42.49 8.93,43.24 v8.89,43.31 | v8.89,39.37 8.75,39.6 8.75,40.84 v8.76,40.89 | 7.33,42.09 7.33,43.51 v7.37,43.56 7.37,46.42 U1.38 | 11.51,38.27 11.51,37.73 v11.56,37.72 | v15.62,43.69 15.75,43.69 v16.38,44.32 16.4,44.31 16.4,43.69 16.75,43.33 v16.76,43.31 16.84,43.24 17.37,42.71 | v17.78,44.2 17.82,44.13 18.08,43.87 18.08,43.51 v18.16,43.43 18.08,43.42 17.37,42.71
  Top 0.152: 17.37,42.71 17.46,42.62 17.46,42.44 v17.53,42.42 17.37,42.71 | v19.3,39.24 19.68,39.24 v20.32,38.61 20.31,38.53 20.31,38.18 19.6,37.47 v19.43,37.47 19.51,37.47 | v23.24,43.69 23.77,43.16 v24,43.31 23.95,43.24 23.51,42.8 23.51,41.91 v23.49,41.91 23.33,41.91 22.88,41.47 v22.86,41.4 22.8,41.47 22.26,41.47 21.37,42.35 v21.34,42.42 21.29,42.44 21.29,43.69 21.11,43.87 v21.08,43.94 21.02,43.87 20.84,43.69 v20.32,43.69 v20.31,43.69 v20.31,44.58 v20.32,44.58 | 23.06,35.95 23.6,35.95 v23.62,35.94 | 23.06,35.95 22.62,35.95 v22.61,35.94 | 23.06,35.95 23.06,36.75 v22.99,36.83 | v22.99,36.83 22.97,36.84 22.17,36.84 v22.1,36.83 22.08,36.84 22.08,39.24 21.64,39.69 v21.59,39.75 21.55,39.78 20.75,40.58 v20.7,40.64 20.75,40.66 19.95,41.47 v19.94,41.53 19.86,41.47 19.06,42.27 v19.05,42.29 | v24.13,36.83 24.13,36.84 23.06,36.84 v22.99,36.83 | 11.51,38.27 15.42,38.27 | 15.42,38.27 14.22,38.23 | v41.02,44.7 41.02,44.76 32.58,44.76 32.04,45.29 v32,45.34 | v38.27,31.06 36.58,29.38 A2.4 | 7.42,3.68 6.35,2.62 6.35,1.33 6.92,0.76 15.34,0.76 RESET.S1 | S2.1 2.54,4.75 v2.54,4.06 | v6.1,4.06 7.04,4.06 7.42,3.68 | 7.42,3.68 R2.1 | 19.84,8.81 19.86,8.84 19.91,8.79 | 15.42,38.27 15.42,37.73 U1.GND
  Top 0.203: v8.89,31.75 7.67,30.53 U1.1 | v14.73,44.2 15.11,44.2 v15.62,43.69
  Bottom 0.152: v8.38,34.16 8.38,32.26 v8.89,31.75 8.84,31.69 8.84,31.33 2.62,25.11 1.64,25.11 U$9.GND1 | v26.67,8.26 26.71,8.22 v31.77,8.22 37.11,2.88 37.11,2.17 37.73,1.55 39.69,1.55 40.75,2.62 U3.27 | UART.4 56.13,41.91 56.49,41.91 67.33,31.06 67.33,26.71 66.18,25.55 U3.35 66.09,25.46 65.2,25.46 64.13,24.4 61.02,24.4 I2C...4 | v52.07,12.57 54.71,12.57 55.78,13.64 56.58,13.64 57.11,14.17 57.11,15.6 56.13,16.57 I2C..4 56.13,16.66 52.58,20.22 v52.58,20.19 | v49.53,20.19 49.47,20.13 49.47,19.77 46.36,16.66 D1.4 | v30.53,26.35 37.15,26.35 37.55,26.76 37.55,28.31 A2.4 D2.4 | v42.42,25.91 42.44,25.91 42.53,25.82 42.53,23.06 v42.55,22.99 41.29,21.73 41.29,17.91 v41.28,17.91 | v42.42,25.91 42.98,25.91 D2.4 | D2.4 I2C...4 | D2.4 | 42.35,25.91 v42.42,25.91 | I2C...4 | v11.95,17.55 8.4,17.55 GND.T | 41.15,34.84 42.09,35.78 v42.16,35.81 | 41.15,34.84 40.04,33.73 40.04,33.02 v40.01,33.02 39.95,33.02 38.27,31.33 v38.27,31.06 | 35.38,40.71 36.58,41.91 A3.4 36.58,42 39.24,44.67 41.02,44.67 | 35.38,40.71 35.33,40.66 34.35,40.66 v34.29,40.64 | 41.15,34.84 37.02,38.98 36.22,38.98 35.42,39.78 35.42,40.66 35.38,40.71 | D3.4 46.36,42.53 44.22,44.67 41.02,44.67 | 41.02,44.67 v41.02,44.7 | 29.69,48.36 31.95,46.09 31.95,45.38 v32,45.34 28.82,42.15 v28.82,41.83 | 29.69,48.36 28.96,49.09 v28.96,49.28 28.23,49.28 26.62,50.89 U3.15 | v21.34,42.42 21.29,42.35 20.75,42.35 19.95,41.55 v19.94,41.53 | v20.32,38.61 20.4,38.62 21.55,39.78 v21.59,39.75 | v17.53,42.42 17.55,42.35 18.97,42.35 v19.05,42.29 | v13.46,42.93 13.46,43.51 14.15,44.2 v14.73,44.2 | 29.69,48.36 24.66,43.33 24.04,43.33 v24,43.31 | v2.54,4.06 v6.1,4.06
  pour Bottom (isolate 0.254, rank 6): -0.13,0.13 68.71,0.13 68.71,53.47 -0.13,53.47
  pour Top (isolate 0.254, rank 6): -0.13,0.13 68.71,0.13 68.71,53.47 -0.13,53.47
IO0  (via drill 0.3)
  Top 0.152: v24.13,6.35 24,6.48 24,15.3 23.14,16.17 18.49,16.17 15.84,18.82 15.84,22.73 18.21,25.1 Q6.3 19.21,25.1 19.21,25.11 19.21,25.82 v19.6,26.2 | v29.38,45.2 28.13,46.44 24.31,46.44 24.22,46.53 24.22,46.71 U1.25
  Bottom 0.152: v24.13,6.35 27.77,2.71 28.04,2.71 U3.32 | v29.38,45.2 29.29,45.29 29.2,45.29 20.24,36.34 20.24,26.85 v19.6,26.2
IO5  (via drill 0.3)
  Top 0.152: 19.25,46.44 19.25,43.26 v24.21,38.3 | 19.25,46.44 19.25,46.46 | v34.8,48.74 36.7,50.65 U3.11 | U1.29 19.15,46.71 19.15,46.53 19.24,46.44 19.25,46.44
  Bottom 0.152: v24.21,38.3 27.86,38.3 34.8,45.24 v34.8,48.74
IO12  (via drill 0.3)
  Top 0.152: S2.3 4.75,1.28 4.75,5.28 S2.4 4.53,5.41 4.53,17.13 3.24,18.43 3.24,24.83 6.46,28.05 6.46,31 9.73,34.27 v23.14,34.27 | v37.38,46.53 41.73,50.89 U3.9 | U1.14 24.18,29.77 24.38,29.97 26.85,29.97 v26.94,29.88
  Bottom 0.152: v26.94,29.88 26.81,29.76 22.29,29.76 21.22,30.82 21.22,33.01 22.48,34.27 v23.14,34.27 25.11,34.27 v37.38,46.53
IO13  (via drill 0.3)
  Top 0.152: v11.63,5.21 11.63,3.71 R4.1 | v16.97,33.66 24.78,33.66 25.26,33.17 | v30.15,46.53 35.18,46.53 39.22,50.57 39.22,50.88 U3.10 | 25.26,33.17 25.29,33.15 | U1.16 25.64,33.2 25.29,33.2 25.26,33.17
  Bottom 0.152: v11.63,5.21 11.63,12.57 6.78,17.42 6.78,25.53 14.91,33.66 v16.97,33.66 29.84,46.53 v30.15,46.53
IO14  (via drill 0.3)
  Top 0.152: v33.55,28.37 33.55,31.57 36.47,34.49 42.34,34.49 45.77,37.92 | 45.77,37.92 45.82,37.97 45.24,38.56 45.24,50.06 45.85,50.67 U3.8 | 45.77,37.92 46.3,37.92 D3.2 | U1.13 22.94,28.69 22.94,28.23 24.71,26.47 v26.42,26.47
  Bottom 0.152: v26.42,26.47 26.54,26.47 29.34,29.26 32.41,29.26 33.3,28.37 v33.55,28.37
IO16  (via drill 0.5)
  Top 0.152: v38.09,40.93 36.31,40.93 33.46,43.78 29.91,43.78 29.18,44.5 23.32,44.5 21.82,46 21.82,46.53 U1.27 | v44.49,43.43 44.49,51.28 45.25,52.05 49.82,52.05 50.89,50.98 U3.6 50.89,50.89 50.89,30.44 46.36,25.91 D2.2
  Bottom 0.152: v38.09,40.93 41.95,40.93 44.45,43.43 v44.49,43.43
IO17
  Top 0.152: D2.1 46.36,21.02 55.78,11.6 56.49,11.6 57.11,12.22 57.11,25.64 56.4,26.35 55.69,26.35 55.16,26.89 55.16,33.29 58.89,37.02 58.89,45.16 53.47,50.58 U3.5 53.47,50.98 51.69,52.76 36.68,52.76 35.47,51.55 35.47,50.2 34.84,49.57 33.39,49.57 32.04,48.22 21.14,48.22 20.45,47.52 20.45,46.91 20.4,46.89 20.4,46.8 U1.28
IO25  (via drill 0.3, 0.35)
  Top 0.152: v38.35,15.6 35.09,15.6 34.09,16.6 34.09,19.6 32.49,21.2 29.38,21.2 22.91,27.66 19.61,27.66 19.24,28.03 19.24,28.57 U1.10 | v51.85,10.64 52.86,9.64 56.93,9.64 67.59,20.29 67.59,31.32 59.78,39.13 59.78,45.82 56.05,49.55 56.05,50.89 U3.4 | v43.31,10.79 43.51,10.59 D1.1
  Bottom 0.152: v38.35,15.6 43.16,10.79 v43.31,10.79 | D1.1 51.8,10.59 v51.85,10.64
IO26  (via drill 0.3)
  Top 0.152: v19.11,30.82 19.82,30.82 20.36,30.29 U1.11 | v54.46,46.69 53.32,45.54 53.32,40.51 51.24,38.44 51.24,29.73 v47.6,26.09
  Bottom 0.152: v19.11,30.82 16.87,28.57 16.87,24.41 17.58,23.7 32.39,23.7 40.89,15.2 | 40.89,15.2 43.51,12.57 46.34,12.57 D1.2 | v54.46,46.69 58.47,50.7 U3.3 | v47.6,26.09 47.87,25.82 47.87,22.17 40.89,15.2
IO27  (via drill 0.3)
  Top 0.152: v30.35,31.13 29.84,31.13 29.32,30.61 22.48,30.61 21.64,29.77 U1.12 | v34.66,31.18 35.42,31.94 42.34,31.94 46.36,35.95 D3.1 46.36,36.04 48.31,38 48.31,50.89 U3.7
  Bottom 0.152: v30.35,31.13 30.4,31.18 v34.66,31.18
IO32  (via drill 0.3)
  Top 0.152: v17.14,30.75 16.56,30.16 U1.8
  Bottom 0.152: v17.14,30.75 16.51,30.11 16.51,24.23 17.4,23.34 23.91,23.34 36.58,10.68 A1.1 36.58,10.53 36.75,10.35 37.64,10.35 39.24,8.75 42.53,8.75 48.58,2.71 50.89,2.71 U3.19
IO33  (via drill 0.35)
  Top 0.152: v33.27,19.3 33.27,16.33 36.58,13.03 A1.2 | v29.08,20.19 29.08,20.87 22.64,27.3 18.67,27.3 17.83,28.15 U1.9
  Bottom 0.152: U3.20 53.39,2.67 46.92,9.14 40.46,9.14 37.02,12.57 36.58,12.57 A1.2 | v33.27,19.3 32.39,20.19 v29.08,20.19
IO34  (via drill 0.3)
  Top 0.152: v17.49,25.69 15.46,25.69 14.02,27.13 U1.6 | v40.49,21.82 43.6,21.82 48.4,17.02 48.4,12.7 55.96,5.14 55.96,2.71 U3.21
  Bottom 0.152: v17.49,25.69 17.79,25.39 36.48,25.39 A2.2 37.02,25.29 v40.49,21.82
IO35  (via drill 0.3, 0.35)
  Top 0.152: v39.69,21.02 43.87,21.02 48.04,16.84 48.04,12.01 54.97,5.09 v54.97,4.89 | v24.51,21.84 25.53,21.84 v25.94,22.26 | v32.26,22.48 32.64,22.86 32.64,24.13 32.61,24.13 v32.43,24.3 | v15.37,30.73 15.37,28.8 U1.7
  Bottom 0.152: v39.69,21.02 37.64,23.06 36.75,23.06 36.58,23.24 A2.1 36.58,23.33 34.98,24.93 33.06,24.93 v32.43,24.3 | v24.51,21.84 24.26,21.84 23.24,22.86 17.38,22.86 16.15,24.08 16.15,30.2 15.62,30.73 v15.37,30.73 | v25.94,22.26 32.04,22.26 v32.26,22.48 | U3.22 56.26,4.95 55.03,4.95 v54.97,4.89
IO36  (via drill 0.3, 0.35, 0.5)
  Top 0.152: v22.1,32.49 13.73,32.49 11.48,30.23 U1.4 | v52.3,6.46 47.69,11.07 47.69,16.66 45.02,19.33 v37.91,19.33 | v35.33,21.91 35.33,22.26 32.58,25.02 32.58,35.33 32.93,35.69 v33.15,35.69
  Bottom 0.152: v22.1,32.49 22.1,31.34 22.83,30.61 27.23,30.61 32.31,35.69 v33.15,35.69 36.31,35.69 36.58,35.95 A3.1 | v35.33,21.91 v37.91,19.33 | v52.3,6.46 57.29,6.46 U3.23
IO39  (via drill 0.3)
  Top 0.152: v23.23,31.48 23.1,31.61 14.1,31.61 12.8,30.31 12.8,28.77 U1.5 | v35.95,19.24 35.95,22.17 32.93,25.2 32.93,34.27 36.58,37.91 A3.2
  Bottom 0.152: v23.23,31.48 27.57,31.48 34,37.91 36.58,37.91 A3.2 | v35.95,19.24 35.95,19.11 45.55,9.51 57.06,9.51 63.6,2.97 63.6,2.71 U3.24
MISO  (via drill 0.3)
  Top 0.152: U3.13 31.6,50.98 30.53,52.05 28.45,52.05 27.83,51.42 27.83,50.33 26.48,48.98 18.08,48.98 16.62,47.52 16.62,47.17 16.57,47.16 16.57,46.8 U1.31 | v43.51,47.87 39.6,47.87 37.64,45.91 v34,45.91
  Bottom 0.152: v43.51,47.87 43.51,47.51 48.22,42.8 48.22,41.47 59.07,30.62 63.6,30.62 U3.38 | v34,45.91 32.75,47.16 32.75,49.47 31.69,50.53 31.69,50.89 U3.13
MOSI  (via drill 0.3)
  Top 0.152: 9.11,46.71 9.11,47.92 v9.22,48.03 | 9.11,46.71 9.11,46.53 | v11.99,48.79 11.99,48.91 12.01,48.93 16.59,48.93 17.35,49.7 22,49.7 22.76,50.46 22.76,51.3 23.94,52.48 32.33,52.48 33.88,50.93 U3.12 | 9.11,46.71 9.02,46.71 U1.37
  Bottom 0.152: v11.99,48.79 11.86,48.92 10.11,48.92 v9.22,48.03 | U3.34 66.09,28.13 65.91,28.13 64.71,29.34 59.82,29.34 47.87,41.29 47.87,42.11 41.14,48.84 36.4,48.84 34.98,50.27 34.98,50.36 34.44,50.89 34.18,50.89 U3.12
N$1
  Top 0.152: CHG.C 20.33,15.2 R3.1
N$2
  Top 0.152: D5.A 13.69,1.96 11.71,1.96 R4.2
N$3  (via drill 0.35)
  Top 0.152: v19.33,21.39 19.84,20.88 19.84,18.86 18.8,17.82 R37.1 | v22.61,21.72 22.61,21.8 21.91,22.49 Q2.1
  Bottom 0.152: v19.33,21.39 19.63,21.08 21.97,21.08 v22.61,21.72
N$4
  Top 0.152: D10.C 9.65,1.96 7.52,1.96 R2.2
N$7  (via drill 0.35)
  Top 0.152: Q6.1 17.72,23 16.89,22.17 v16.89,22.1 | R36.1 21.08,21.46 v20.83,21.72
  Bottom 0.152: v20.83,21.72 20.83,21.97 20.7,22.1 v16.89,22.1
PROG
  Top 0.152: R5.2 22.73,7.75 20.85,7.75 20.62,7.52 U5.5
RESET  (via drill 0.3, 0.35)
  Top 0.152: C9.1 12.24,9.35 14.68,9.35 14.71,9.37 | RESET.2 22,3.71 24.66,3.71 27.41,0.96 31.29,0.96 32.97,2.64 33.12,2.64 U3.30 32.82,2.64 32.82,3.33 30.45,5.69 24.74,5.69 | 24.74,5.69 17.73,5.69 17.02,6.4 17.02,7.85 15.52,9.35 14.76,9.35 14.71,9.37 | v15.32,26.95 20.05,26.95 21.86,25.14 22.82,25.14 Q2.3 | 24.74,5.69 24.74,13.03 v24.74,14.22 | v24.51,18.54 23.59,19.46 23.59,21.95 22.86,22.68 Q2.3 | v12.65,26.82 11.41,26.82 10.21,28.02 U1.3 | Q2.3 22.86,25.3 v21.82,26.34 | 14.71,9.37 R1.1
  Bottom 0.152: v15.32,26.95 15.19,26.82 v12.65,26.82 | v21.82,26.34 24.89,26.34 28.93,30.38 57.3,30.38 61.95,25.73 62.69,25.73 62.84,25.58 63.6,25.58 U3.36 | v24.51,18.54 24.74,18.32 v24.74,14.22
RXI  (via drill 0.3, 0.35)
  Top 0.152: v36.96,8.2 32.23,12.93 31.77,12.93 U6.2 | 12.93,46.71 12.93,47.79 13.72,48.58 16.89,48.58 17.65,49.34 24.89,49.34 25.21,49.66 v25.21,49.7 | 12.93,46.71 12.93,46.53 | v33.46,52.49 35.37,52.49 35.99,53.11 61.47,53.11 63.6,50.98 U3.1 63.69,50.89 64.94,49.64 64.94,40.31 68.26,36.98 68.26,19.88 56.26,7.87 v55.5,7.87 | v49.4,7.87 39.76,7.87 v39.69,7.95 | 12.93,46.71 U1.34
  Bottom 0.152: v39.69,7.95 39.43,8.2 v36.96,8.2 | v25.21,49.7 25.21,51.35 26.44,52.58 33.38,52.58 v33.46,52.49 | UART.1 56.13,36.46 54.62,37.97 54.62,42.62 61.29,49.29 61.82,49.29 63.42,50.89 63.6,50.89 U3.1 | v55.5,7.87 v49.4,7.87
SCK  (via drill 0.3)
  Top 0.152: 17.87,46.8 17.87,47.78 18.67,48.58 26.96,48.58 29.08,50.7 U3.14 | 17.87,46.8 17.87,46.79 | U3.37 62.97,28.07 62.09,28.94 v62.09,31.6 | v57.65,37.17 57.65,45.53 54.12,49.06 53.44,49.06 52.17,50.33 52.17,51.55 51.32,52.4 38.81,52.4 37.95,51.54 37.95,49.86 35.69,47.6 v32.13,47.6 | U1.30 17.91,46.8 17.87,46.8
  Bottom 0.152: v62.09,31.6 57.65,36.04 v57.65,37.17 | v32.13,47.6 29.11,50.62 29.11,50.89 U3.14
SCL_22  (via drill 0.3)
  Top 0.152: 10.35,46.71 10.35,49.43 13.86,52.93 16.93,52.93 18.88,50.98 U3.18 | 10.35,46.71 10.35,46.53 | v54.46,36.5 54.46,25.81 v54.71,25.55 | 10.35,46.71 10.26,46.71 U1.36
  Bottom 0.152: I2C..1 56.13,10.62 57.02,10.62 57.65,11.24 57.65,20.93 56.49,22.08 56.49,22.88 56.13,23.24 I2C...1 56.13,23.33 55.69,23.33 54.62,24.4 54.62,25.46 v54.71,25.55 | v54.46,36.5 54.62,36.66 54.62,36.93 44.13,47.42 44.13,51.42 42.44,53.11 20.84,53.11 18.97,51.24 18.97,50.98 U3.18
SDA_21  (via drill 0.3)
  Top 0.152: v13.79,45.26 13.92,45.39 13.92,46.3 14.15,46.53 14.15,46.71 14.08,46.71 U1.33 | 54.61,24.21 54.61,13.92 55.91,12.62 56.13,12.62 I2C..2 | I2C...2 56.13,25.22 55.39,24.47 54.88,24.47 54.61,24.21 | 54.61,24.21 54.56,24.15 53.09,25.63 v53.09,31.29 | v27.79,47.37 28.09,47.37 31.22,44.25 36.4,44.25 41.05,39.6 v41.05,38.84
  Bottom 0.152: v13.79,45.26 13.82,45.29 16.1,45.29 21.46,50.65 U3.17 21.46,50.57 24.66,47.37 v27.79,47.37 | v41.05,38.84 48.06,31.83 52.55,31.83 v53.09,31.29
STAT
  Top 0.152: U5.1 20.62,10.11 20.62,10.49 22.61,12.47 R3.2
TXO  (via drill 0.3)
  Top 0.152: v33.57,14.83 33,14.26 31.77,14.26 U6.3 | v34.84,17.12 34.84,17.14 36,18.31 | 36,18.31 42,24.31 46.71,24.31 52.49,30.09 52.49,35.93 54.47,37.91 56.13,37.91 UART.2 56.13,38 57.11,38.98 57.11,44.77 56.24,45.64 v56.13,45.64 | v21.12,34.89 21.12,39.05 18.62,41.55 16.13,41.55 11.68,46 11.68,46.53 11.51,46.71 U1.35 | v25.81,28.79 28.66,25.93 28.66,24.49 31.6,21.55 32.75,21.55 36,18.31
  Bottom 0.152: v34.84,17.12 34.84,16.1 v33.57,14.83 | v21.12,34.89 20.74,34.51 20.74,30.56 22.5,28.79 v25.81,28.79 | v56.13,45.64 61.02,50.53 61.02,50.89 U3.2
V_USB  (via drill 0.35)
  Top 0.203: U3.28 38.23,2.87 39.75,4.39 43.94,4.39 45.62,2.72 45.85,2.72 U3.25 | U2.1 13.65,22.48 13.27,22.86 12.07,22.86 11.75,22.54 11.75,22.49 | 11.71,22.45 10.6,23.57 D9.C 9.58,24.89 6.84,27.63 6.84,30.76 9.02,32.93 17.11,32.93 17.29,33.11 22.87,33.11 24.93,31.05 26.87,31.05 28.16,32.33 28.16,39.4 31.37,42.61 C1.1 | 11.71,22.45 11.71,21.82 11.66,21.77 | Q3.2 10.73,19.81 | 10.73,19.81 10.73,20.72 11.64,21.62 U2.3 11.75,22.49 | v10.16,19.81 10.73,19.81 | 11.75,22.49 11.71,22.45
  Bottom 0.203: U3.28 38.23,3.2 27.89,13.54 22.66,13.54 16.38,19.81 v10.16,19.81
  pour Top (isolate 0.254, no thermals): 3.81,23.24 5.97,23.24 5.97,22.54 3.81,22.54
VBAT  (via drill 0.35)
  Top 0.203: X1.2 7.29,11.86 8.2,11.86 10.19,13.84 11.63,13.84 Q3.3 11.79,13.84 11.81,13.82 12.88,13.82 14.66,12.04 v14.78,12.04 | C3.1 17.02,13.34 v17.02,12.19 | U5.3 18.73,11.12 19.56,11.94 v19.56,12.07
  Bottom 0.203: v14.78,12.04 16.99,12.04 17.02,12.07 | 17.02,12.07 v17.02,12.19 | v19.56,12.07 17.02,12.07
VBUS  (via drill 0.35)
  Top 0.203: U5.4 18.72,7.52 18.72,7.59 17.83,8.48 17.83,11.24 CHG.A 19.55,13.6 17.53,15.62 17.53,16.48 15.21,18.8 | Q3.1 12.7,15.82 13.92,15.82 15.21,17.12 15.21,18.8 | 15.21,18.8 v15.21,23.88 15.21,24.92 14.68,25.45 14.3,25.39 D9.A | v9.53,23.49 8.71,22.68 4.44,22.68 U$9.1
  Bottom 0.203: VCC.T 8.38,24.64 v9.53,23.49 14.86,23.49 15.24,23.88 v15.21,23.88

### Text on the board
tPlace: 5 | 1 | 3 | SCL / 22 | SDA / 21 | NC | 18 | 19 | 23 | 13 | 12 | 14 | 27 | 16 | 17 | 25 | 26 | GND | TX | RX | GND | GND | GND | VCC | VCC | VCC | 39 | 14 | TX 1 | 36 | 27 | RX 3 | GND | GND | GND | VCC | VCC | VCC | 34 | 16 | SDA / 21 | 35 | 17 | MISO | VCC | SCL / 22 | SCK | MOSI | RST | GND | GND | GND | GND | VCC | VCC | VCC | 33 | 26 | SDA 21 | 32 | 25 | SCL 22 | RESET | ANALOG IN | PWR | IO13 | 0 | 3V3 | RST | 3V3 | 5V | GND | GND | 5V | 32 | 33 | 34 | 35 | 36 | 39 | IO12
bPlace: Blocky ESP32
bPlate: A0 | A2 | A4 | SPI | UART